# EAGLE design Tube Board (EAGLE 8.2.1)
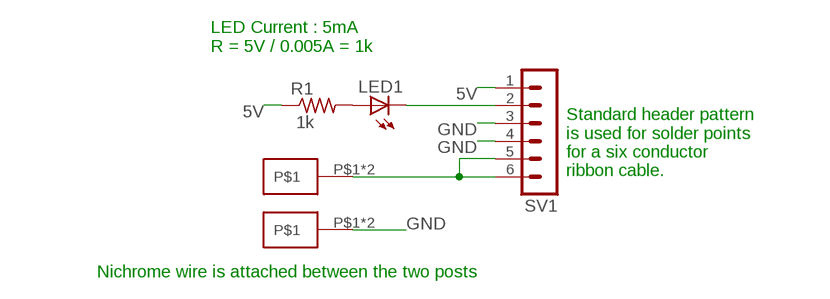
[diagram p0: schematic, sheet 1]

## Parts
LED1  LED_ESML0603  [LED_SML0603]
R1  R-US_R0603  [R0603]
SV1  MA06-1  [MA06-1]
U$1  A29938CT  [A29938CT]
U$2  A29938CT  [A29938CT]

## Nets
5V: R1.1 SV1.1
GND: SV1.3 SV1.4 U$2.P$1 U$2.P$2
N$1: SV1.5 SV1.6 U$1.P$1 U$1.P$2
N$2: LED1.A R1.2
N$3: LED1.C SV1.2

## Notes on the sheet
- LED Current : 5mA
  R = 5V / 0.005A = 1k
- Standard header pattern
  is used for solder points
  for a six conductor 
  ribbon cable.
- Nichrome wire is attached between the two posts

## Library data of the parts
LED1 = eagle-ltspice:LED_E: LED Source: http://www.osram.convergy.de Source: www.luxeon.com Source: www.kingbright.com; SPICEMODEL: NONE; SPICEPREFIX: D; SPICETYPE: diode
R1 = resistor:R-US_: RESISTOR, American symbol; R1: 1k
SV1 = con-lstb:MA06-1: PIN HEADER; OC_FARNELL: unknown; OC_NEWARK: unknown
U$1 U$2 = Mylib:A29938CT

## Board
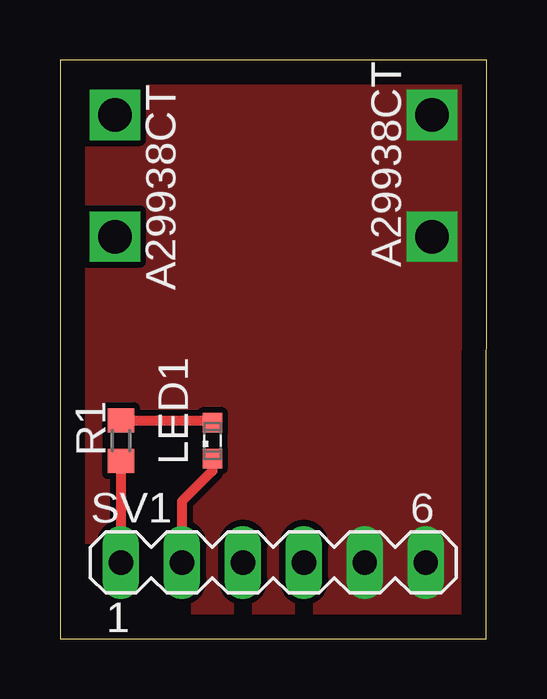
[diagram p1: board, top side]
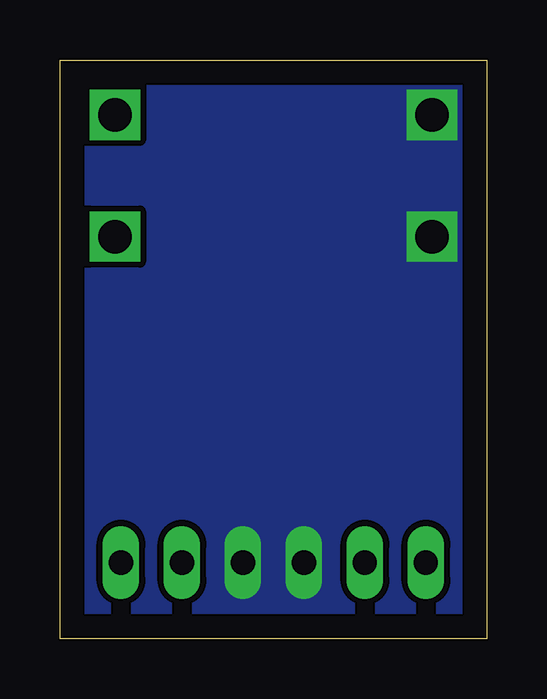
[diagram p2: board, bottom side, seen from below]

Size 17.78 x 24.13 mm. Coordinates in mm from the lower left corner, seen from the top.
Outline: 0,0 17.76,0 17.78,24.13 0,24.13 0,0
Copper layers (1*16): Top 0.035mm / dielectric 1.5mm / Bottom 0.035mm
Design rules "default *": minimum track width 10mil, minimum drill 24mil, track to track 10mil, track to pad 10mil, pad to pad 10mil, via to via 10mil, smd to smd 8mil, copper to edge 40mil, drill to drill 8mil, minimum pad ring 10mil, minimum via ring 8mil, stop-mask expansion 4mil, vias tented up to drill 0mil, thermal gap 10mil

### Footprints (pad centres in the part's own frame; a part is rotated, then mirrored left to right if it is on the bottom)
LED_SML0603 = smd 0.8 x 0.8: A 0.75,0; C -0.75,0
R0603 = smd 1 x 1.1: 1 -0.85,0; 2 0.85,0
MA06-1 = drill 1.016 long: 1 -6.35,0; 2 -3.81,0; 3 -1.27,0; 4 1.27,0; 5 3.81,0; 6 6.35,0
A29938CT = drill 1.397 square: P$1 0,0; P$2 5.08,0

### Placement (x,y rotation side)
LED1  6.35,8.26 90 top
R1  2.54,8.26 90 top
SV1  8.89,3.17 0 top
U$1  15.49,16.76 90 top
U$2  2.29,21.84 270 top

### Tracks (layer width: path | path; a pad name or v marks a point on that pad's centre or on a via)
5V
  Top 0.406: R1.1 SV1.1
GND
  pour Bottom (no thermals): 0,0 17.78,0 17.78,24.13 0,24.13
N$1
  pour Top (no thermals): 0,0 17.78,0 17.78,24.13 0,24.13
N$2
  Top 0.406: R1.2 6.25,9.11 LED1.A
N$3
  Top 0.406: SV1.2 5.08,5.71 6.35,6.99 LED1.C